# EAGLE schematic Bad USB schematic (EAGLE 9.7.0)
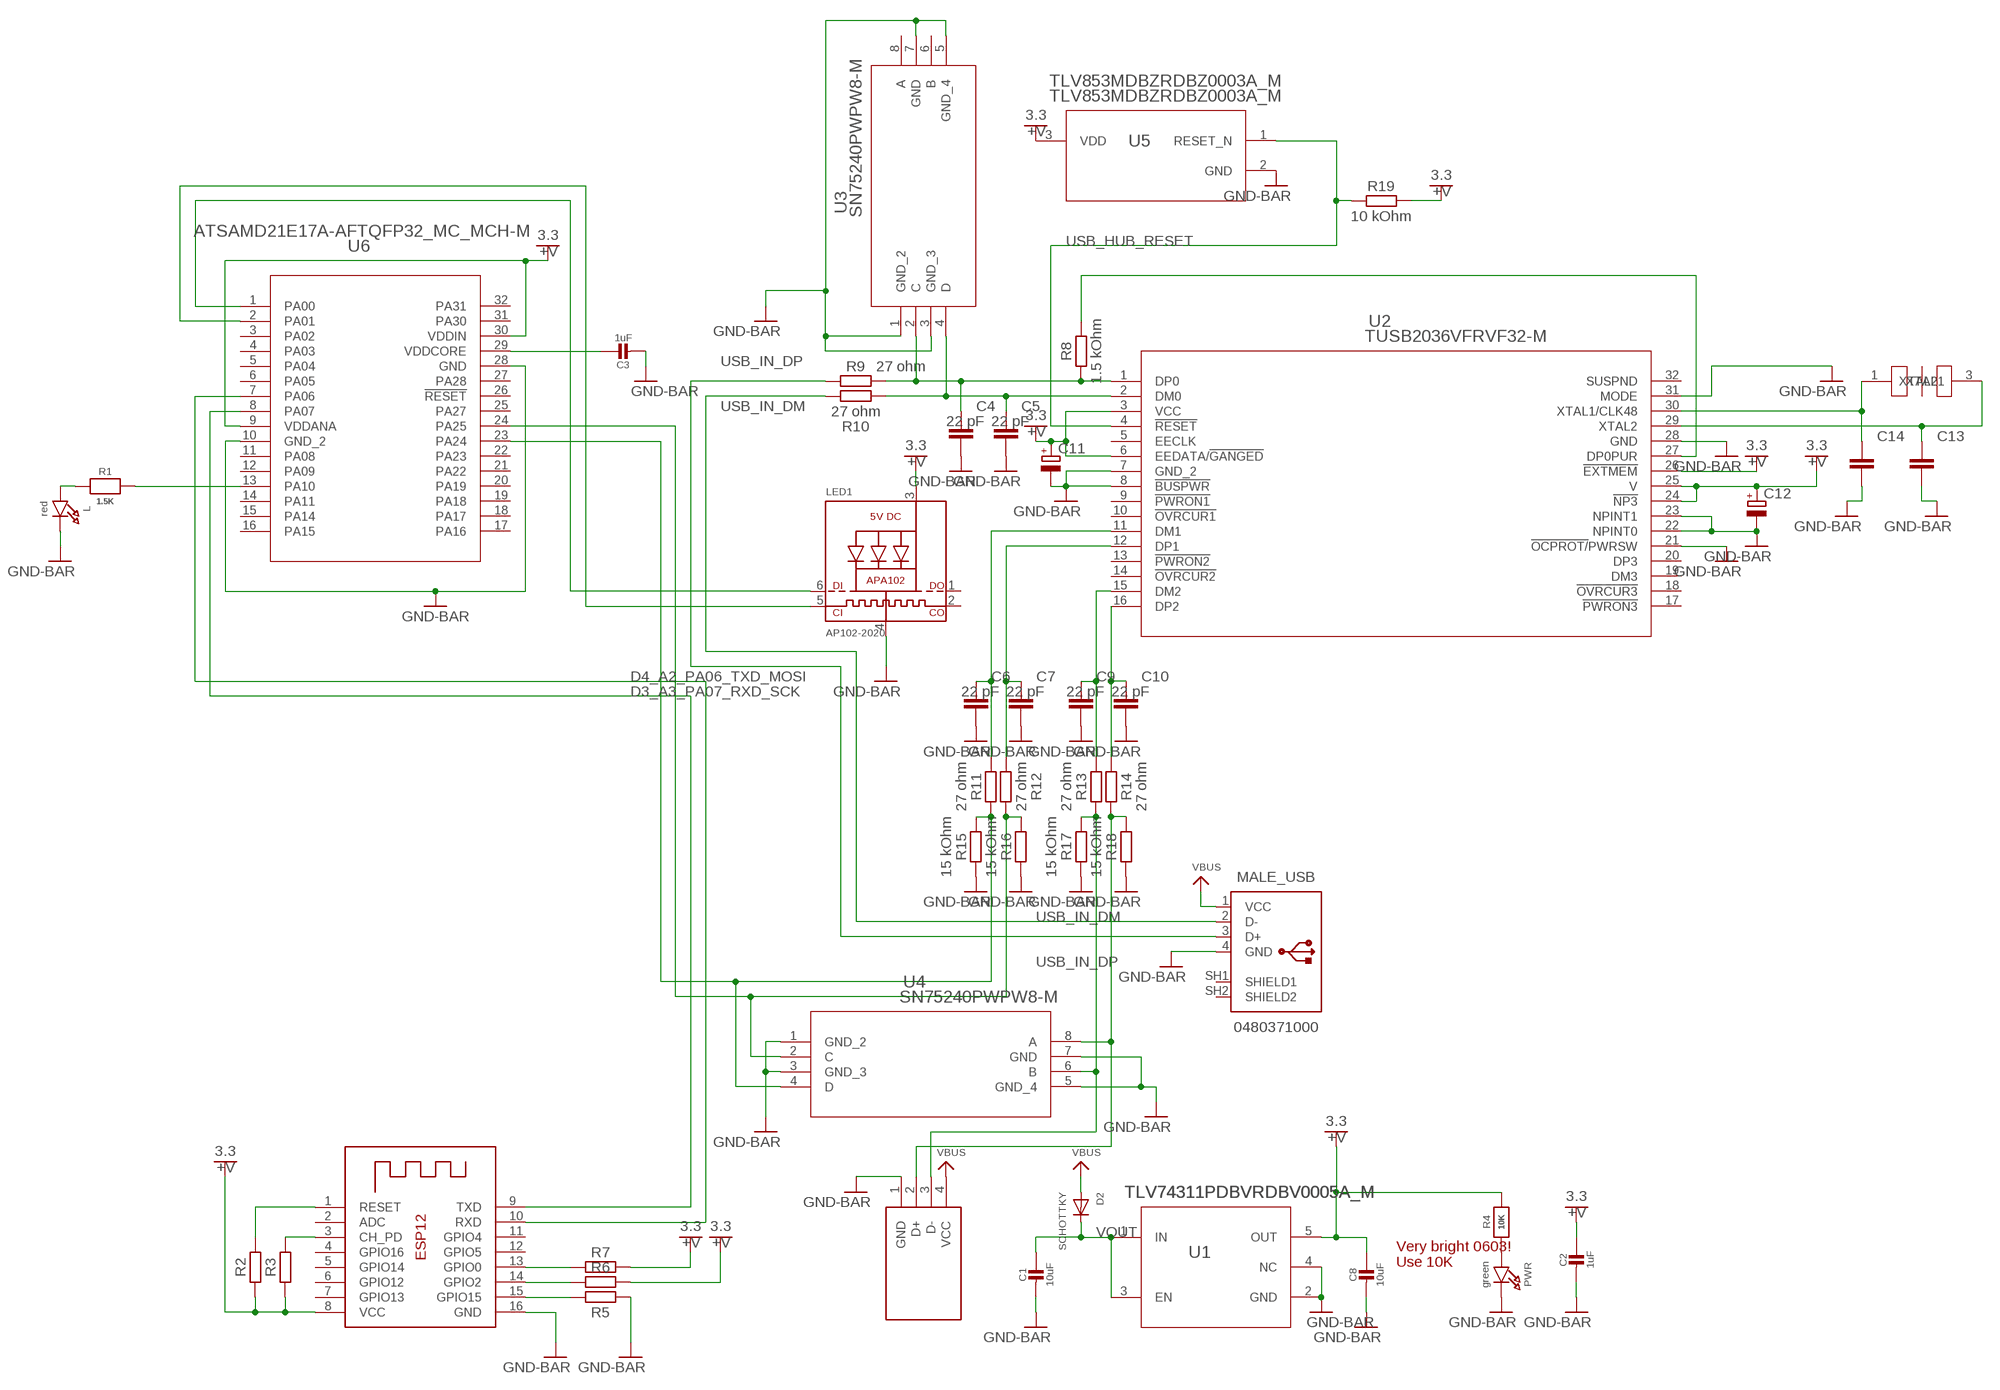
[diagram p0: schematic, sheet 1]

## Parts
C1  10uF  CAP_CERAMIC0805-NOOUTLINE  [0805-NO]
C2  1uF  CAP_CERAMIC0603_NO  [0603-NO]
C3  1uF  CAP_CERAMIC0603_NO  [0603-NO]
C4  22 pF  C_CHIP-0402(1005-METRIC)  [CAPC1005X60]
C5  22 pF  C_CHIP-0402(1005-METRIC)  [CAPC1005X60]
C6  22 pF  C_CHIP-0402(1005-METRIC)  [CAPC1005X60]
C7  22 pF  C_CHIP-0402(1005-METRIC)  [CAPC1005X60]
C8  10uF  CAP_CERAMIC0805-NOOUTLINE  [0805-NO]
C9  22 pF  C_CHIP-0402(1005-METRIC)  [CAPC1005X60]
C10  22 pF  C_CHIP-0402(1005-METRIC)  [CAPC1005X60]
C11  C-POL_TANTALUM-1206(3216-METRIC)  [CAPMP3216X180N]
C12  C-POL_TANTALUM-1206(3216-METRIC)  [CAPMP3216X180N]
C13  C_CHIP-0402(1005-METRIC)  [CAPC1005X60]
C14  C_CHIP-0402(1005-METRIC)  [CAPC1005X60]
D2  SCHOTTKY  DIODE_SOD-123FL  [SOD-123FL]
L  red  LED0603_NOOUTLINE  [CHIPLED_0603_NOOUTLINE]
LED1  AP102-2020  APA1022020  [APA102_2020]
MALE_USB  0480371000  [0480371000]
PWR  green  LED0603_NOOUTLINE  [CHIPLED_0603_NOOUTLINE]
R1  1.5K  RESISTOR_0603_NOOUT  [0603-NO]
R2  R_CHIP-0603(1608-METRIC)  [RESC1608X60]
R3  R_CHIP-0603(1608-METRIC)  [RESC1608X60]
R4  10K  RESISTOR_0603_NOOUT  [0603-NO]
R5  R_CHIP-0603(1608-METRIC)  [RESC1608X60]
R6  R_CHIP-0603(1608-METRIC)  [RESC1608X60]
R7  R_CHIP-0603(1608-METRIC)  [RESC1608X60]
R8  1.5 kOhm  R_CHIP-0402(1005-METRIC)  [RESC1005X40]
R9  27 ohm  R_CHIP-0402(1005-METRIC)  [RESC1005X40]
R10  27 ohm  R_CHIP-0402(1005-METRIC)  [RESC1005X40]
R11  27 ohm  R_CHIP-0402(1005-METRIC)  [RESC1005X40]
R12  27 ohm  R_CHIP-0402(1005-METRIC)  [RESC1005X40]
R13  27 ohm  R_CHIP-0402(1005-METRIC)  [RESC1005X40]
R14  27 ohm  R_CHIP-0402(1005-METRIC)  [RESC1005X40]
R15  15 kOhm  R_CHIP-0402(1005-METRIC)  [RESC1005X40]
R16  15 kOhm  R_CHIP-0402(1005-METRIC)  [RESC1005X40]
R17  15 kOhm  R_CHIP-0402(1005-METRIC)  [RESC1005X40]
R18  15 kOhm  R_CHIP-0402(1005-METRIC)  [RESC1005X40]
R19  10 kOhm  R_CHIP-0402(1005-METRIC)  [RESC1005X40]
U1  TLV74311PDBVRDBV0005A_M  [DBV0005A_M]
U2  TUSB2036VFRVF32-M  [VF32-M]
U3  SN75240PWPW8-M  [PW8-M]
U4  SN75240PWPW8-M  [PW8-M]
U5  TLV853MDBZRDBZ0003A_M  [DBZ0003A_M]
U6  ATSAMD21E17A-AFTQFP32_MC_MCH-M  [TQFP32_MC_MCH-M]
U$1  H10S-6.000-20-3050-TR  [H10S-6.000-20-3050-TR__PACKAGE]
U$9  USBFLASHBREAKOUT  [USBFLASHBREAKOUT]
X1  ESP-12-THROUGH-HOLE  [ESP-12THROUGH-HOLE]

## Nets
+V: C2.1 C8.1 C11.1(+) C12.1(+) LED1.3(VDD) R2.1 R3.1 R4.2 R6.2 R7.2 R19.2 U1.5(OUT) U2.3(VCC) U2.6(EEDATA/!GANGED) U2.24(!NP3) U2.25(V) U2.26(!EXTMEM) U5.3(VDD) U6.9(VDDANA) U6.30(VDDIN) X1.8(VCC)
A3: LED1.6(DI) U6.1(PA00)
D3_A3_PA07_RXD_SCK: U6.8(PA07) X1.9(TXD)
D4_A2_PA06_TXD_MOSI: U6.7(PA06) X1.10(RXD)
GND: C1.2 C2.2 C3.2 C4.2 C5.2 C6.2 C7.2 C8.2 C9.2 C10.2 C11.2(-) C12.2(-) C13.2 C14.2 L.C LED1.4(GND) MALE_USB.4(GND) PWR.C R5.1 R15.1 R16.1 R17.1 R18.1 U1.2(GND) U1.4(NC) U2.7(GND_2) U2.8(!BUSPWR) U2.21(!OCPROT/!PWRSW) U2.22(NPINT0) U2.23(NPINT1) U2.28(GND) U2.31(MODE) U3.1(GND_2) U3.3(GND_3) U3.5(GND_4) U3.7(GND) U4.1(GND_2) U4.3(GND_3) U4.5(GND_4) U4.7(GND) U5.2(GND) U6.10(GND_2) U6.28(GND) U$9.1(GND) X1.16(GND) ; supply symbol labelled GND-BAR
N$3: C3.1 U6.29(VDDCORE)
N$5: R2.2 X1.1(RESET)
N$6: PWR.A R4.1
N$7: R3.2 X1.3(CH_PD)
N$8: LED1.5(CKI) U6.2(PA01)
N$9: R5.2 X1.15(GPIO15)
N$10: R6.1 X1.14(GPIO2)
N$11: R7.1 X1.13(GPIO0)
N$13: R12.1 R16.2 U4.2(C) U6.24(PA25)
N$14: C14.1 U2.30(XTAL1/CLK48) U$1.1(XTAL1)
N$15: C13.1 U2.29(XTAL2) U$1.3(XTAL2)
N$16: R8.2 U2.27(DP0PUR)
N$20: C4.1 R8.1 R9.2 U2.1(DP0) U3.2(C)
N$21: C5.1 R10.2 U2.2(DM0) U3.4(D)
N$22: C9.1 R13.2 U2.15(DM2)
N$23: C10.1 R14.2 U2.16(DP2)
N$24: C6.1 R11.2 U2.11(DM1)
N$25: C7.1 R12.2 U2.12(DP1)
N$26: R13.1 R17.2 U4.6(B) U$9.3(D-)
N$31: R14.1 R18.2 U4.8(A) U$9.2(D+)
N$32: R11.1 R15.2 U4.4(D) U6.23(PA24)
PA10: R1.2 U6.13(PA10)
RED_LED-R1_1.5K: L.A R1.1
USB_HUB_RESET: R19.1 U2.4(!RESET) U5.1(RESET_N)
USB_IN_DM: MALE_USB.2(D-) R10.1
USB_IN_DP: MALE_USB.3(D+) R9.1
VBUS: D2.A MALE_USB.1(VCC) U$9.4(VCC)
VOUT: C1.1 D2.C U1.1(IN) U1.3(EN)
Unconnected: LED1.1(DO) LED1.2(CKO) MALE_USB.SH1(SHIELD1) MALE_USB.SH2(SHIELD2) U2.5(EECLK) U2.9(!PWRON1) U2.10(!OVRCUR1) U2.13(!PWRON2) U2.14(!OVRCUR2) U2.17(!PWRON3) U2.18(!OVRCUR3) U2.19(DM3) U2.20(DP3) U2.32(SUSPND) U3.6(B) U3.8(A) U6.3(PA02) U6.4(PA03) U6.5(PA04) U6.6(PA05) U6.11(PA08) U6.12(PA09) U6.14(PA11) U6.15(PA14) U6.16(PA15) U6.17(PA16) U6.18(PA17) U6.19(PA18) U6.20(PA19) U6.21(PA22) U6.22(PA23) U6.25(PA27) U6.26(!RESET) U6.27(PA28) U6.31(PA30) U6.32(PA31) X1.2(ADC) X1.4(GPIO16) X1.5(GPIO14) X1.6(GPIO12) X1.7(GPIO13) X1.11(GPIO4) X1.12(GPIO5)

## Notes on the sheet
- Very bright 0603!
  Use 10K

## Library data of the parts
C1-C3 C8 = microbuilder:CAP_CERAMIC: Ceramic Capacitors For new designs, use the packages preceded by an '_' character since they are more reliable: The following footprints should be used on most boards: _0402 - Standard footprint for regular board layouts _0603 - Standard footprint for regular board layouts _0805 - Standard footprint for regular board layouts _1206 - Standard footprint for regular board layouts For extremely tight-pitch boards where space is at a premium, the following 'micro-pitch' footprints can be used (smaller pads, no silkscreen outline, etc.): _0402MP - Micro-pitch footprint for very dense/compact boards _0603MP - Micro-pitch footprint for very dense/compact boards _0805MP - Micro-pitch footprint for very dense/compact boards _1206MP - Micro-pitch footprint for very dense/compact boards
C4-C7 C9 C10 C13 C14 = Capacitor:C: Capacitor - Generic; CATEGORY: Capacitor
C11 C12 = Capacitor:C-POL: Capacitor Polarised - Generic; CATEGORY: Capacitor
D2 = adafruit:DIODE: Diode SMADIODE - SMA Surface Mount Package 20V 1A Schottky Diode Digikey: 641-1014-6-ND DO-1N4148 - Through Hole Small Current Diode SOD-123 20V 1 A (.5mV Vf) Schottky Diode - Digikey: MBRX120TPMSCT-ND SOD-323 10V 570mA (.38mV Vf, 3ns) Schottky Diode - Digikey: ZLLS410CT-ND SOD-523 30V 30mA Schottky Diode (RB751S-40TE61) - Digikey: RB751S-40TE61CT-ND SOT23-R/W - SOT23 Package (R = Solder Paste/Reflow Ovens, W = Hand-Soldering) BAT54Film 40V 300mA - Digikey: 497-7162-1-ND
L PWR = microbuilder:LED: LED 0603 - 0603 Surface Mount Package 2mA: Green LED - Low Power (3.9mcd, 2ma, 1.7Vf) - Digikey: 475-2709-2-ND Orange LED - Low Power (9.8mcd, 2ma, 1.8Vf) - Digikey: 475-1194-2-ND Red LED - Low Power (5mcd, 2ma, 1.8Vf) - Digikey: 475-1195-2-ND Yellow LED - Low Power (7mcd, 2ma, 1.8Vf) - Digikey: 475-1196-2-ND 5mA: Blue LED - Low Power (17mcd, 5ma, 2.9Vf) - Digikey: LNJ937W8CRACT-ND 0805 - 0805 Surface Mount Package 2mA: Red LED (8.8mcd, 2mA, 1.8Vf, Clear) - Low Power [Digikey: 475-2510-1-ND] Green LED (5mcd, 2mA, 1.8Vf, Clear) - Low Power [Digikey: 475-2730-1-ND] Yellow LED (11.3mcd, 2mA, 1.8Vf, Clear) - Low Power [Digikey: 475-2555-1-ND] 20mA: Red LED (104mcd, 20mA, Diffused) - LS R976 [Digikey: 475-1278-6-ND] Red LED (12mcd, 20mA, 2.0Vf, Clear) - APT2012EC [Digikey: 754-1128-1-ND] Green LED (15mcd, 20mA, 2.2Vf, Clear) - APT2012GC [Digikey: 754-1131-1-ND] Orange LED (160mcd, 20mA, 2.1Vf, Clear) - APT2012SECK [Digikey: 754-1130-1-ND] 1206 - 1206 Surface Mount Package Green LED (26mcd, 20mA, Diffused) - LG N971 [Digikey: 475-1407-6-ND] Red LED (15mcd, 20mA, Diffused) - LH N974 [Digikey: 475-1416-6-ND] Cree - Cree High-Power Surface Mount LEDs XPEBWT-L1-0000-00D50 - White 111lm 350mA 2.9Vf 6200K 110° XTEAWT-00-0000-00000LEE3 - White 114lm 350mA 2.85Vf 5000K 115° Everlight - Everlight 45-21 Series Surface Mount LEDs 45-21/QK2C-B2832AC2CB2/2T - Warm White 2000mcd 20mA 3.25Vf 3050K 120° 45-21/LK2C-B38452C4CB2/2T - Nuetral White 2000mcd 20mA 3.25Vf 4150K 120° 45-21/LK2C-B50634C6CB2/2T - Cold White 2200mcd 20mA 3.25Vf 5650K 120° PLCC2 Reverse Mount LS T77K-J1L2-1-0-2-R18-Z - Red 11.25mcd 2mA 1.8Vf 630nm 120° LO T77K-L1M2-24-Z - Orange 19.6mcd 2mA 1.8Vf 606nm 120° LY T77K-K2M1-26-Z - Yellow 15.7mcd 2mA 1.8Vf 587nm 120°
LED1 = microbuilder:APA102: APA102/DotStar Pixels VCC: 5V DC Refresh Rate: 400Hz
MALE_USB = Connector_USB:0480371000: USB(2.0) Type-A, PLUG, 4POS, SMD-THT-R/A Datasheet <https://www.molex.com/pdm_docs/sd/480371000_sd.pdf> Drawing <https://www.molex.com/pdm_docs/sd/480371000_sd.pdf>; CATEGORY: Connector; CONTACTS: 4; CURRENT_RATING: 1.5A; DESCRIPTION: CONN PLUG USB2.0 TYPEA 4P SMD RA; GENDER: Male; MANUFACTURER: Molex; MOUNT_TYPE: R/A; MPN: 0480371000; OPERATING_TEMP: -20° to +85°C; PART_STATUS: Active; ROHS_COMPLIANT: RoHS Compliant; SERIES: 48037; SUB-CATEGORY: USB; TYPE: USB-A; VOLTAGE_RATING: 150V AC (RMS)
R1 R4 = microbuilder:RESISTOR: Resistors For new designs, use the packages preceded by an '_' character since they are more reliable: The following footprints should be used on most boards: _0402 - Standard footprint for regular board layouts _0603 - Standard footprint for regular board layouts _0805 - Standard footprint for regular board layouts _1206 - Standard footprint for regular board layouts For extremely tight-pitch boards where space is at a premium, the following 'micro-pitch' footprints can be used (smaller pads, no silkscreen outline, etc.): _0402MP - Micro-pitch footprint for very dense/compact boards _0603MP - Micro-pitch footprint for very dense/compact boards _0805MP - Micro-pitch footprint for very dense/compact boards _1206MP - Micro-pitch footprint for very dense/compact boards
R2 R3 R5-R19 = Resistor:R: Resistor Fixed - Generic; CATEGORY: Resistor; SUB-CATEGORY: Fixed
U1 = vReg:TLV74311PDBVR; COPYRIGHT: Copyright (C) 2022 Ultra Librarian. All rights reserved.; DIGI-KEY_PART_NUMBER_1: 296-50002-1-ND; DIGI-KEY_PART_NUMBER_2: 296-50002-2-ND; DIGI-KEY_PART_NUMBER_3: 296-50002-6-ND; DIGI-KEY_PART_NUMBER_4: TLV74311PDBVR-ND; MANUFACTURER_PART_NUMBER: TLV74311PDBVR; MFR_NAME: Texas Instruments; REFDES: RefDes; TYPE: TYPE
U2 = usb hub ic:TUSB2036VFR; COPYRIGHT: Copyright (C) 2022 Ultra Librarian. All rights reserved.; DIGI-KEY_PART_NUMBER_1: 296-27129-1-ND; DIGI-KEY_PART_NUMBER_2: 296-27129-2-ND; DIGI-KEY_PART_NUMBER_3: 296-27129-6-ND; DIGI-KEY_PART_NUMBER_4: 2156-TUSB2036VFR-ND; MANUFACTURER_PART_NUMBER: TUSB2036VFR; MFR_NAME: Texas Instruments
U3 U4 = TI SN75240:SN75240PW; COPYRIGHT: Copyright (C) 2022 Ultra Librarian. All rights reserved.; MANUFACTURER_PART_NUMBER: SN75240PW; MFR_NAME: Texas Instruments
U5 = Reset ic:TLV853MDBZR; COPYRIGHT: Copyright (C) 2022 Ultra Librarian. All rights reserved.; MANUFACTURER_PART_NUMBER: TLV853MDBZR; MFR_NAME: Texas Instruments; REFDES: RefDes; TYPE: TYPE
U6 = M0 Cortex FIXED:ATSAMD21E17A-AF; COPYRIGHT: Copyright (C) 2022 Ultra Librarian. All rights reserved.; MANUFACTURER_PART_NUMBER: ATSAMD21E17A-AF; MFR_NAME: Microchip
U$1 = H10S-6.000-20-3050-TR   Crystal Library:H10S-6.000-20-3050-TR
U$9 = USB FLASH:USBFLASHBREAKOUT
X1 = adafruit:ESP-12-THROUGH-HOLE

## Net classes
1 power: width 0.305 mm